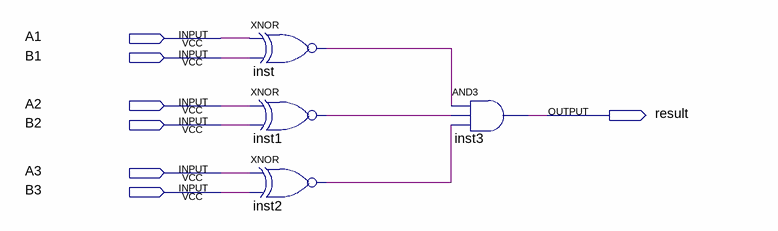
[diagram p0: schematic sheet]
// Quartus schematic euqal.bdf as structural Verilog: 4 symbols, 7 pins
module euqal (
  input  A1,
  input  B1,
  input  A2,
  input  B2,
  input  A3,
  input  B3,
  output result
);

  wire inst1_out, inst2_out, inst_out;

  xnor inst (inst_out, A1, B1);
  xnor inst1 (inst1_out, A2, B2);
  xnor inst2 (inst2_out, A3, B3);
  and inst3 (result, inst_out, inst1_out, inst2_out);
endmodule
